# Altium schematic sheet Schematic 2.SchDoc
size A4; SheetNumber: 1; SheetTotal: 1
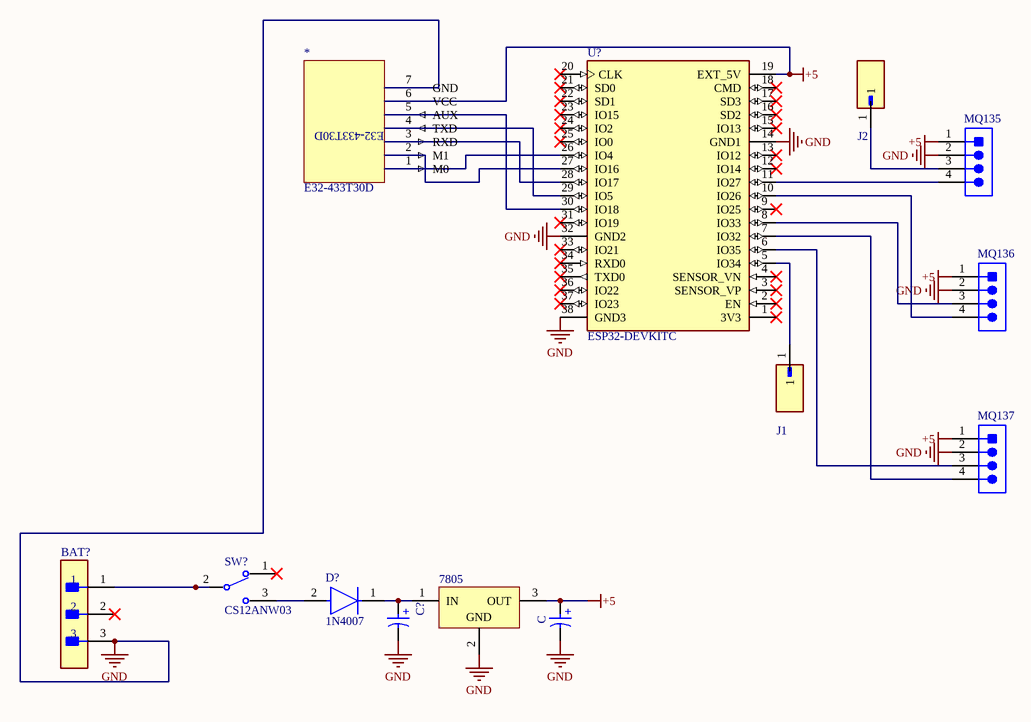
[diagram p0: Schematic 2.SchDoc]

## Parts
7805  L7805CP  [TO220FP]  (value not drawn)
*  E32-433T30D  [E32-433T30D]
BAT?  B03B-PASK-1(LF)(SN)  [FP-B03B-PASK-1_LF_SN-MFG]  (value not drawn)
C  860160274015  [WCAP-ATLL_D8H11.5]  (value not drawn)
C?  860160274015  [WCAP-ATLL_D8H11.5]  (value not drawn)
D?  1N4007  [FP-1N4007-MFG]
J1  BM01B-ACHSS-A-GAN-ETF(LF)(SN)  [JST_BM01B-ACHSS-A-GAN-ETF(LF)(SN)]  (value not drawn)
J2  BM01B-ACHSS-A-GAN-ETF(LF)(SN)  [JST_BM01B-ACHSS-A-GAN-ETF(LF)(SN)]  (value not drawn)
MQ135  B4B-PH-K-S(LF)(SN)  [JST-B4B-PH-K-S_V]  (value not drawn)
MQ136  B4B-PH-K-S(LF)(SN)  [JST-B4B-PH-K-S_V]  (value not drawn)
MQ137  B4B-PH-K-S(LF)(SN)  [JST-B4B-PH-K-S_V]  (value not drawn)
SW?  CS12ANW03  [FP-CS12ANW03-MFG]
U?  ESP32-DEVKITC  [MODULE_ESP32-DEVKITC]

## Nets
+5: 7805.3(OUT) *.6(VCC) C.1(P) MQ135.1 MQ136.1 MQ137.1 U?.19(EXT_5V)
GND: 7805.2(GND) *.7(GND) BAT?.3 C.2(N) C?.2(N) MQ135.2 MQ136.2 MQ137.2 U?.14(GND1) U?.32(GND2) U?.38(GND3)
Net7805_1: 7805.1(IN) C?.1(P) D?.1(C)
Net*_1: *.1(M0) U?.26(IO4)
Net*_2: *.2(M1) U?.27(IO16)
Net*_3: *.3(RXD) U?.28(IO17)
Net*_4: *.4(TXD) U?.29(IO5)
Net*_5: *.5(AUX) U?.30(IO18)
NetBAT?_1: BAT?.1 SW?.2(2(COM))
NetD?_2: D?.2(A) SW?.3
NetJ1_1: J1.1 U?.5(IO34)
NetJ2_1: J2.1 MQ135.3
NetMQ135_4: MQ135.4 U?.11(IO27)
NetMQ136_3: MQ136.3 U?.8(IO33)
NetMQ136_4: MQ136.4 U?.10(IO26)
NetMQ137_3: MQ137.3 U?.6(IO35)
NetMQ137_4: MQ137.4 U?.7(IO32)

Not connected (* = marked no-connect by the designer): BAT? 2*; SW? 1*; U? 1(3V3)* 2(EN)* 3(SENSOR_VP)* 4(SENSOR_VN)* 9(IO25)* 12(IO14)* 13(IO12)* 15(IO13)* 16(SD2)* 17(SD3)* 18(CMD)* 20(CLK)* 21(SD0)* 22(SD1)* 23(IO15)* 24(IO2)* 25(IO0)* 31(IO19)* 33(IO21)* 34(RXD0)* 35(TXD0)* 36(IO22)* 37(IO23)*

## Notes on the sheet
- (in symbol CMP-03913-54007388-2) +

## Library data of the parts
7805 = CMP-0244-00474-1: Positive Voltage Regulator, 5V, 3-Pin TO-220FP; ComponentLink1Description: Manufacturer URL; ComponentLink2Description: Datasheet; DatasheetVersion: 16/11/2011; PackageDescription: TO, Thru-Hole, Vertical, Heatsink Mounted; 3 In-Line Leads; Pitch 2.54 mm; ComponentLink2URL: http://www.st.com/internet/com/TECHNICAL_RESOURCES/TECHNICAL_LITERATURE/DATASHEET/CD00000444.pdf; ComponentLink1URL: http://www.st.com; PackageVersion: 2011; PackageReference: TO220FP
BAT? = CMP-17439-000193-1: CONN HEADER VERT 3POS 2MM; Voltage Rating: 250V; Current Rating: 3A; Mated Stacking Heights: 14.9mm; Number of Positions: 3; Packaging: Bulk; Contact Type: Male Pin; Flammability Rating: UL94 V-0; Contact Shape: Square; Number of Rows: 1; Color: Natural; Orientation: Straight; Housing Color: White; Fastening Type: Ramp; Insulation Material: PBT; Insulation Color: Natural; Mount: Through Hole; Contact Finish - Mating: TIN; Connector Type: Header; Termination: Solder; Contact Mating Length: 0.126inch; Lead Free: Lead Free; Contact Material: Copper Alloy; Pitch: 2mm; Series: PA; Number of Contacts: 3; Contact Plating: Tin
C C? = CMP-03913-54007388-2: Aluminium Electrolytic Capacitor-Leaded Rohs Compliant: Yes; Leakage Current: 27µA; Polarity: Polar; Voltage Rating: 10V; Ripple Current: 420mA; Pitch: 3.5mm; Impedance: 530mΩ; Life (Hours): 7000hours; Capacitance: 270µF; Tolerance: 20%; Mount: Through Hole; Max Operating Temperature: 105°C; Length: 11.5mm; Lead Pitch: 3.5052mm; Min Operating Temperature: -55°C; Height - Seated (Max): 13.0048mm; Case/Package: Radial; Diameter: 8mm; Packaging: Tape & Box (TB); RoHS: Compliant
D? = CMP-123542-000001-1: Rectifier diode 1000 V 1 A DO-41, ,; Manufacturer: Diotec; Max Surge Forward Current: 27A; Forward Current: 1A; Max Junction Temp: +175°C; Reverse Voltage: 1000V; Value: 15pF; Peak Reverse Current: 5uA; Category: Diode; Temperature Range Low: -50°C; Automotive: No; Temperature: -50°C to +175°C; Lead Free: Yes; ComponentLink2Description: Datasheet; Max Repetitive Reverse Voltage: 1000V; ComponentLink2URL: https://datasheet.octopart.com/1N4007-Diotec-datasheet-62346875.pdf; Manufacturer Part Number: 1N4007; Device Class L3: Rectifier Diodes; Height: 2.8mm; Octopart: https://octopart.com/1n4007-diotec-4040411; Package: 1N4007; Temperature Range High: +175°C; Device Class L1: Discrete Semiconductors; Device Class L2: Diodes; RoHS: TRUE; Capacitance: 15pF; Ipc Land Pattern Name: DIOAD888W100L520D280
J1 J2 = BM01B-ACHSS-A-GAN-ETF(LF)(SN): Connector Header Surface Mount, Right Angle 1 position; MF: JST Sales America Inc.; SnapEDA_Link: https://www.snapeda.com/parts/BM01B-ACHSS-A-GAN-ETF(LF)(SN)/JST/view-part/?ref=snap; Package: None; Value: *; MP: BM01B-ACHSS-A-GAN-ETF(LF)(SN); Check_prices: https://www.snapeda.com/parts/BM01B-ACHSS-A-GAN-ETF(LF)(SN)/JST/view-part/?ref=eda
MQ135-MQ137 = CMP-2000-05165-1: Male Header, Pitch 2 mm, 1 x 4 Position, Height 6 mm, Tail Length 3.4 mm, -25 to 85 degC, RoHS, Bulk; Manufacturer: JST; No of Positions: 4; Style/Orientation: StraightHeader/Plug; Pitch: 2mm; Datasheet URL: http://datasheet.octopart.com/B4B-PH-K-S%28LF%29%28SN%29-JST-datasheet-10558886.pdf; Type: ShroudedHeader; Manufacturer URL: http://www.jst.com/home2.html; Termination: Crimp; Datasheet Version: Apr-09
SW? = CMP-31746-000002-1: SWITCH SLIDE SPDT 3A 125V; Max Voltage Rating (AC): 250V; Mechanical Life: 50000Cycles; Switch Travel: 2.2mm; Electrical Life: 20000Cycles; Actuator Length: 5.1mm; Illumination Type: Non-Illuminated; Contact Style: Non-Shorting; Actuator Type: Standard; Actuator Material: Nylon; Switch Function: On-On; Max Operating Temperature: 85°C; Series: CS; Contact Current Rating: 3A; Min Operating Temperature: -30°C; Current Rating: 3A; Mount: Through Hole; Depth: 7.5mm; RoHS Compliant: Yes; Throw Configuration: SPDT; Lead Free: Lead Free; Orientation: Vertical; Contact Plating: Silver; Reach SVHC Compliant: Yes; Termination: PC Pin; Max Current Rating: 3A; Packaging: Tray; Length: 14mm; Package Quantity: 1; Primary Type: SWITCH; Flammability Rating: UL94 V-0; Contact Material: Copper; Voltage Rating (AC): 125V
U? = ESP32-DEVKITC: Transceiver; 802.11 b/g/n (Wi-Fi, WiFi, WLAN), BluetoothÂ® Smart Ready 4.x Dual Mode; MF: Espressif Systems; MP: ESP32-DEVKITC-32D-F; SnapEDA_Link: https://www.snapeda.com/parts/ESP32-DEVKITC-32D-F/Espressif+Systems/view-part/?ref=snap; Package: None; Value: *; Check_prices: https://www.snapeda.com/parts/ESP32-DEVKITC-32D-F/Espressif+Systems/view-part/?ref=eda